# EAGLE design Wireless Temp Sensor (EAGLE 6.5.0)
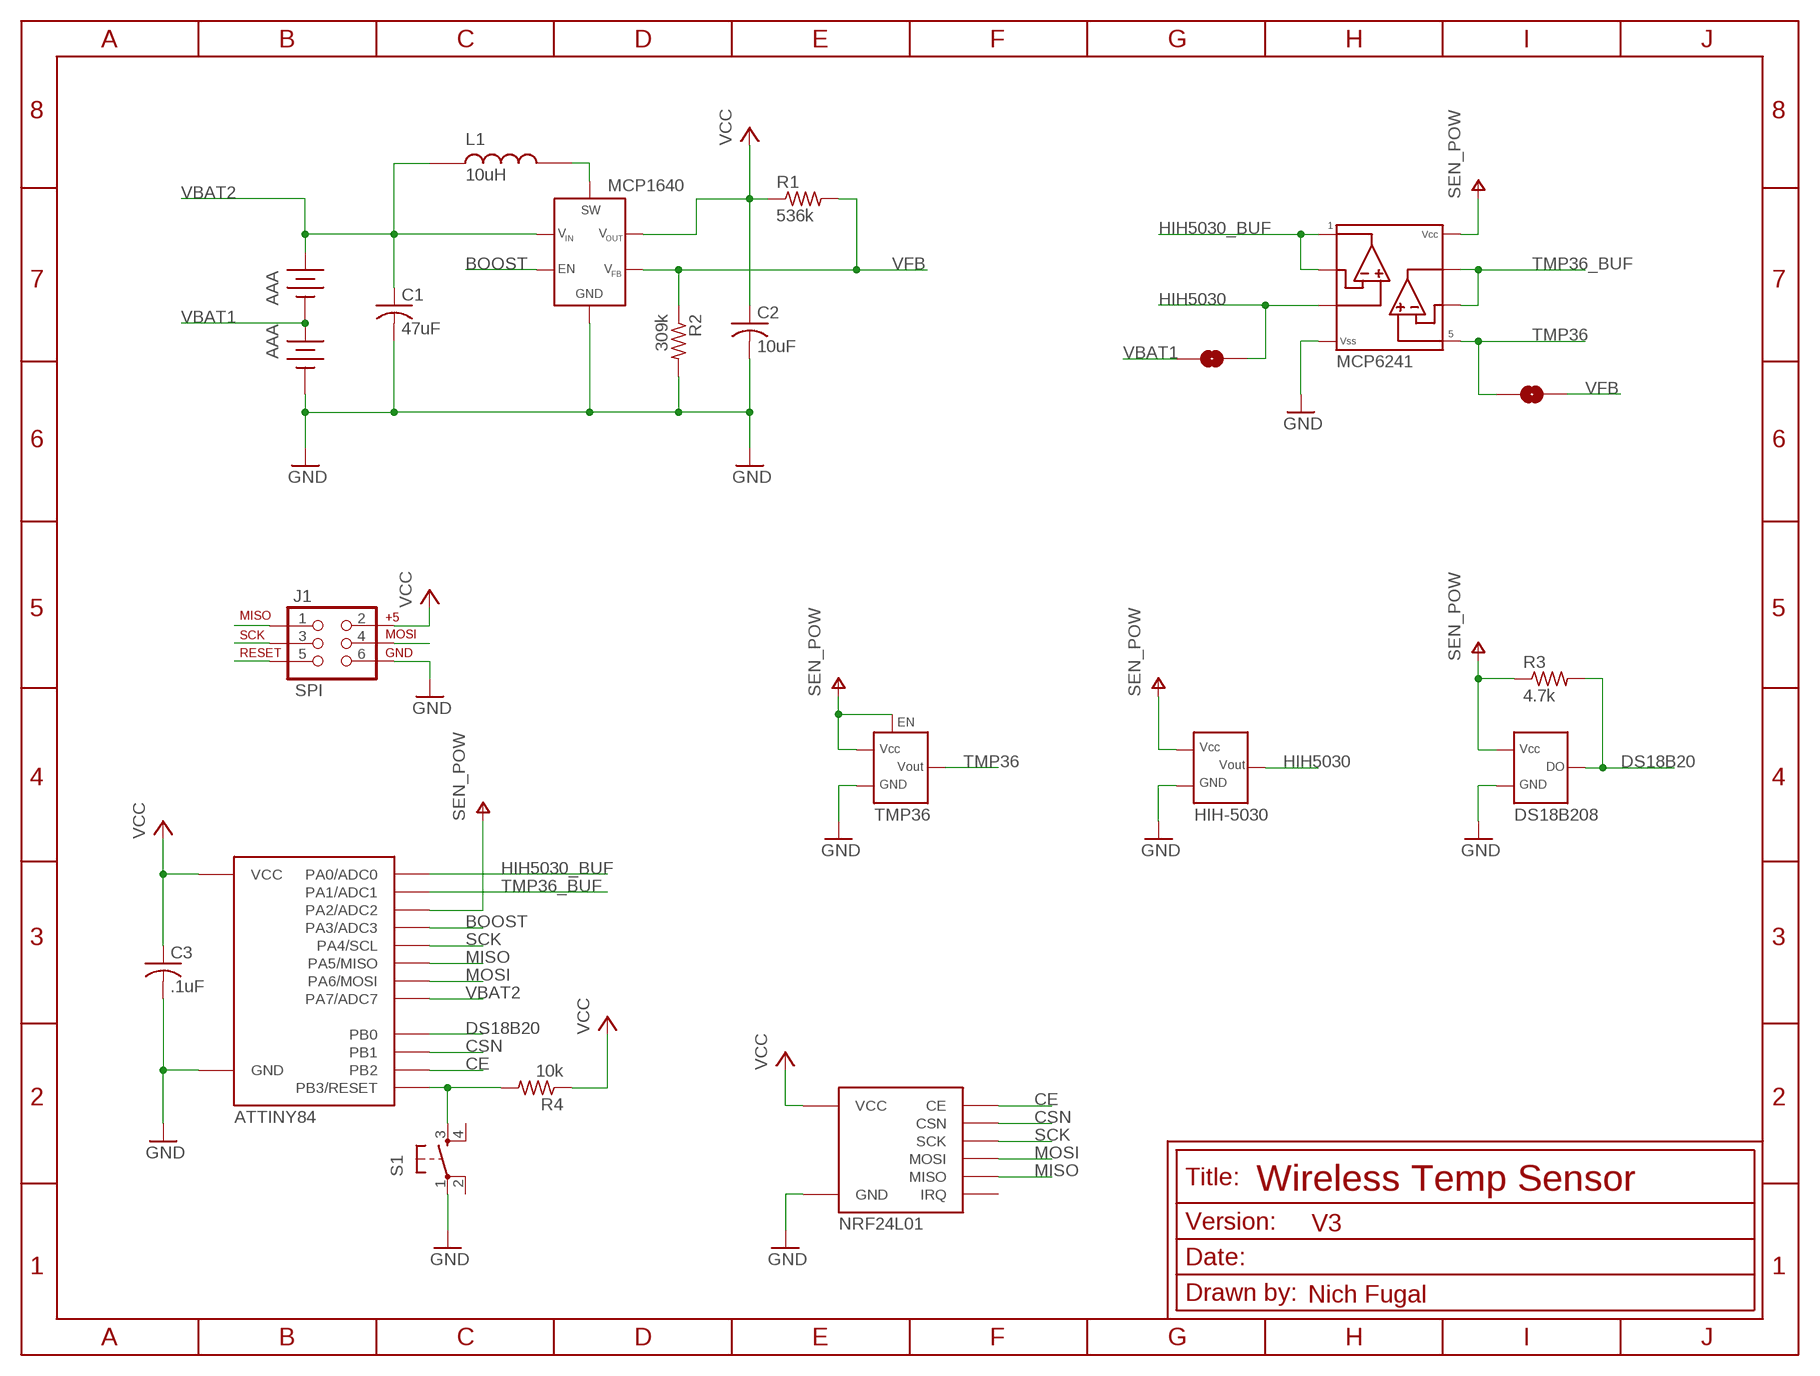
[diagram p0: schematic, sheet 1]

## Parts
C1  47uF  C-USC0805  [C0805]
C2  10uF  C-USC0805  [C0805]
C3  .1uF  C-USC0805  [C0805]
J1  SPI  AVR_SPI_PRG_6PTH  [2X3]
R1  536k  R-US_M0805  [M0805]
R2  309k  R-US_M0805  [M0805]
R3  4.7k  R-US_M0805  [M0805]
R4  10k  R-US_M0805  [M0805]
S1  TAC_SWITCHPTH  [TACTILE-PTH]
SJ1  SOLDERJUMPER-OLDNO  [SJ_2S-NO]
SJ2  SOLDERJUMPER-OLDNO  [SJ_2S-NO]
U1  TMP36  [SOT-23-5]
U$1  MCP1640  MCP1640SOT-23  [SOT-23]
U$2  10uH  INDUCTORSD3114  [SD3114]
U$3  AAA  [BK-82_MPD]
U$4  ATTINY84  ATTINY8414-DIP  [14-DIP]
U$5  NRF24L01  [NRF24L01]
U$6  DS18B208  DS18B208-MSOP  [8-MSOP]
U$7  HIH-5030  [HIH-5030]
U$8  AAA  [BK-82_MPD]
U$9  MCP6241  [8-SOIC]

## Nets
BOOST: U$1.3(EN) U$4.P$10(PA3/ADC3)
CE: U$4.P$5(PB2) U$5.P$3(CE)
CSN: U$4.P$3(PB1) U$5.P$4(CSN)
DS18B20: R3.2 U$4.P$2(PB0) U$6.P$1(DO)
GND: C1.2 C2.2 C3.2 J1.6 R2.2 S1.1 U1.5(GND) U$1.2(GND) U$4.P$14(GND) U$5.P$1(GND) U$6.P$4(GND) U$7.GND U$8.P$3(-) U$8.P$4(-) U$9.P$4
HIH5030: SJ1.1 U$7.OUT U$9.P$3
HIH5030_BUF: U$4.P$13(PA0/ADC0) U$9.P$1 U$9.P$2
MISO: J1.1 U$4.P$8(PA5/MISO) U$5.P$7(MISO)
MOSI: J1.4 U$4.P$7(PA6/MOSI) U$5.P$6(MOSI)
N$1: U$1.1(SW) U$2.P$2
RESET: J1.5 R4.2 S1.3 U$4.P$4(PB3/RESET)
SCK: J1.3 U$4.P$9(PA4/SCL) U$5.P$5(SCK)
SEN_POW: R3.1 U1.2(VCC) U1.4(EN) U$4.P$11(PA2/ADC2) U$6.P$8(VCC) U$7.VCC U$9.P$8
TMP36: SJ2.1 U1.1(VOUT) U$9.P$5
TMP36_BUF: U$4.P$12(PA1/ADC1) U$9.P$6 U$9.P$7
VBAT1: SJ1.2 U$3.P$3(-) U$3.P$4(-) U$8.P$1(+) U$8.P$2(+)
VBAT2: C1.1 U$1.6(VIN) U$2.P$1 U$3.P$1(+) U$3.P$2(+) U$4.P$6(PA7/ADC7)
VCC: C2.1 C3.1 J1.2 R1.1 R4.1 U$1.5(VOUT) U$4.P$1(VCC) U$5.P$2(VCC)
VFB: R1.2 R2.1 SJ2.2 U$1.4(VFB)
Unconnected: S1.2 S1.4 U$5.P$8(IRQ)

## Notes on the sheet
- L1
- 10uH
- AAA
- AAA
- V3
- Nich Fugal

## Library data of the parts
C1-C3 = rcl:C-US: CAPACITOR, American symbol
J1 = sparkfun:AVR_SPI_PRG_6: AVR ISP 6 Pin This is the reduced ISP connector for AVR programming. Common on Arduino. This footprint will take up less PCB space and can be used with a 10-pin to 6-pin adapter such as SKU: BOB-08508
R1-R4 = rcl:R-US_: RESISTOR, American symbol
S1 = sparkfun:TAC_SWITCH: Momentary Switch Button commonly used for reset or general input. Spark Fun Electronics SKU : COM-00097
SJ1 SJ2 = sparkfun:SOLDERJUMPER-OLD: Solder Jumper Standard SMD solder jumper. Used to automate production. Two varients : Normally Open and Normally Closed are the same, but have different paste layers. NC will have a large amount of paste and should jumper during reflow.
U1 = nich:TMP36
U$1 = nich:MCP1640: DC-DC Boost Converter
U$2 = nich:INDUCTOR
U$3 U$8 = nich:AAA
U$4 = nich:ATTINY84
U$5 = nich:NRF24L01
U$6 = nich:DS18B20
U$7 = nich:HIH-5030
U$9 = nich:MCP6241

## Board
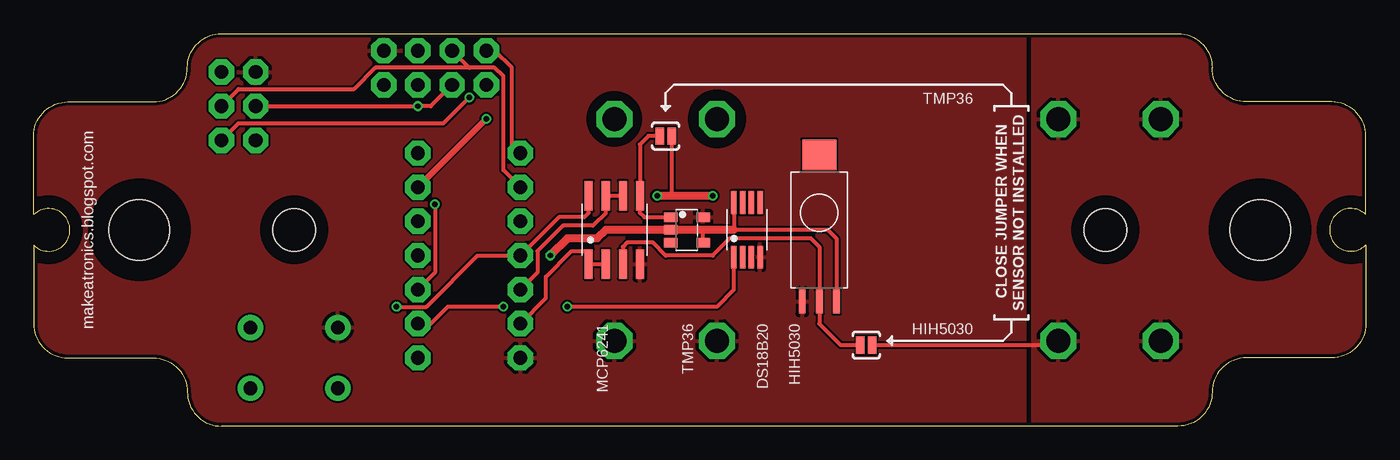
[diagram p1: board, top side]
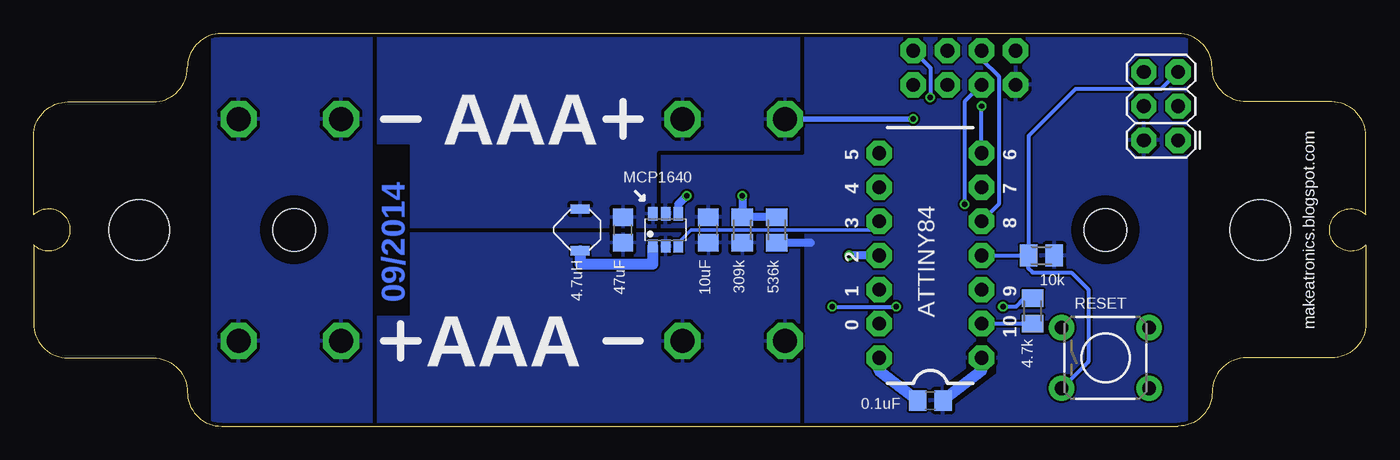
[diagram p2: board, bottom side, seen from below]

Size 99.06 x 29.21 mm. Coordinates in mm from the lower left corner, seen from the top.
Outline: 0,13.47 arc269 0,15.73 0,21.59 arc-90 2.54,24.13 8.89,24.13 arc90 11.43,26.67 arc-90 13.97,29.21 85.09,29.21 arc-90 87.63,26.67 arc90 90.17,24.13 96.52,24.13 arc-90 99.06,21.59 99.06,15.74 arc269 99.06,13.48 99.06,7.62 arc-90 96.52,5.08 90.17,5.08 arc90 87.63,2.54 arc-90 85.09,0 13.97,0 arc-90 11.43,2.54 arc90 8.89,5.08 2.54,5.08 arc-90 0,7.62 0,13.47
Copper layers (1*16): Top 0.035mm / dielectric 1.5mm / Bottom 0.035mm
Design rules "Fusion_eagle_rule_v1.1": minimum track width 6mil, minimum drill 12mil, track to track 6mil, track to pad 6mil, pad to pad 6mil, via to via 6mil, smd to smd 0mil, copper to edge 10mil, drill to drill 10mil, minimum pad ring 10mil, minimum via ring 6mil, stop-mask expansion 2mil, vias tented up to drill 100mil, thermal gap 10mil
Holes 3.17 mm at 19.37,14.61 79.69,14.61
Holes 4.5 mm at 7.86,14.61 91.2,14.61
tKeepout: area 17,5.1 to 21.7,24.1; area 77.3,5.1 to 82.1,24.1
bKeepout: area 4,10.8 to 11.7,18.4; area 87.4,10.8 to 95,18.4; 1 lines
tRestrict: area 48.8,20.9 to 52.8,24.9; area 41.3,21 to 45.1,24.8; area 4,10.8 to 11.7,18.4; area 87.4,10.8 to 95,18.4; area 77.2,12.1 to 82.2,17.1; area 16.8,12.1 to 21.9,17.1; area -1.4,12.1 to 3.7,17.1; area 95.4,12.1 to 100.5,17.1
bRestrict: area 27.6,1.4 to 31.3,6; area 71.1,8.3 to 73.7,21; area 16.8,12.1 to 21.9,17.1; area 77.2,12.1 to 82.2,17.1; 7 lines

### Footprints (pad centres in the part's own frame; a part is rotated, then mirrored left to right if it is on the bottom)
C0805 = smd 1.3 x 1.5: 1 -0.95,0; 2 0.95,0
2X3 = drill 1.016 pad 1.88 octagon: 1 0,0; 2 0,2.54; 3 2.54,0; 4 2.54,2.54; 5 5.08,0; 6 5.08,2.54
M0805 = smd 1.3 x 1.6: 1 -0.95,0; 2 0.95,0
TACTILE-PTH = drill 1.016 pad 1.88: 1 -3.251,2.261; 2 3.251,2.261; 3 -3.251,-2.261; 4 3.251,-2.261
SJ_2S-NO = smd 0.635 x 1.27: 1 -0.45,0; 2 0.45,0
SOT-23-5 = smd 0.7 x 1: 1 -0.95,-1.2; 2 0,-1.2; 3 0.95,-1.2; 4 0.95,1.2; 5 -0.95,1.2
SOT-23 = smd 0.7 x 1: 1 -0.95,-1.2; 2 0,-1.2; 3 0.95,-1.2; 4 0.95,1.2; 5 0,1.2; 6 -0.95,1.2
SD3114 = smd 0.7 x 1.4: P$1 -1.55,0; P$2 1.55,0
BK-82_MPD = drill 1.778 octagon: P$1 0.635,0; P$2 -6.985,0; P$3 -40.005,0; P$4 -32.385,0
14-DIP = drill 1.016 pad 1.88 octagon: P$1 0,0; P$2 2.54,0; P$3 5.08,0; P$4 7.62,0; P$5 10.16,0; P$6 12.7,0; P$7 15.24,0; P$8 15.24,7.62; P$9 12.7,7.62; P$10 10.16,7.62; P$11 7.62,7.62; P$12 5.08,7.62; P$13 2.54,7.62; P$14 0,7.62
NRF24L01 = drill 1.016 pad 1.88 octagon: P$1 0,0; P$2 -2.54,0; P$3 0,2.54; P$4 -2.54,2.54; P$5 0,5.08; P$6 -2.54,5.08; P$7 0,7.62; P$8 -2.54,7.62
8-MSOP = smd 1.702 x 0.406: P$1 -2.032,0; P$2 -2.032,-0.65; P$3 -2.032,-1.3; P$4 -2.032,-1.951; P$5 2.032,-1.951; P$6 2.032,-1.3; P$7 2.032,-0.65; P$8 2.032,0
HIH-5030 = smd 0.508 x 1.778: GND -1.27,-5.334; OUT 0,-5.334; VCC 1.27,-5.334 | smd 2.54 x 2.286: NC 0,5.588
8-SOIC = smd 0.6 x 2.2: P$1 -1.905,-2.54; P$2 -0.635,-2.54; P$3 0.635,-2.54; P$4 1.905,-2.54; P$5 1.905,2.54; P$6 0.635,2.54; P$7 -0.635,2.54; P$8 -1.905,2.54

### Placement (x,y rotation side)
C1  55.24,14.61 270 bottom
C2  48.9,14.61 270 bottom
C3  32.38,1.91 180 bottom
J1  13.97,21.27 90 bottom
R1  43.81,14.61 90 bottom
R2  46.35,14.61 270 bottom
R3  24.77,8.57 270 bottom
R4  24.13,12.7 180 bottom
S1  19.37,5.08 0 bottom
SJ1  61.91,6.03 0 top
SJ2  46.99,21.59 0 top
U1  48.58,14.61 270 top
U$1  52.07,14.61 0 bottom
U$2  58.42,14.61 270 bottom
U$3  43.81,22.86 0 bottom
U$4  28.57,5.08 90 bottom
U$5  26.04,27.94 90 bottom
U$6  52.07,14.61 90 top
U$7  58.42,14.61 0 top
U$8  83.19,6.35 180 bottom
U$9  43.18,14.61 0 top

### Tracks (layer width: path | path; a pad name or v marks a point on that pad's centre or on a via)
BOOST
  Bottom 0.254: U$1.3 51.12,13.65 50.16,14.61 36.83,14.61 U$4.P$10
CE
  Bottom 0.305: U$5.P$3 28.57,27.3 27.3,26.04 27.3,16.51 U$4.P$5
CSN  (via drill 0.41)
  Top 0.305: v29.84,16.51 29.84,11.43 U$4.P$3
  Bottom 0.305: U$5.P$4 29.84,24.13 v29.84,16.51
DS18B20  (via drill 0.41)
  Top 0.305: v39.69,8.89 50.8,8.89 52.07,10.16 U$6.P$1 | v34.92,8.89 30.8,8.89 29.53,7.62 U$4.P$2
  Bottom 0.305: v39.69,8.89 v34.92,8.89 | R3.2 U$4.P$2
GND
  Bottom 0.813: C3.2 36.2,4.13 U$4.P$14
  pour Bottom: 42.07,14.45 73.66,14.45 73.66,0 42.07,0
  pour Top: 73.66,0 0,0 0,29.21 73.66,29.21
HIH5030
  Top 0.305: U$9.P$3 43.81,13.34 44.13,13.65 46.04,13.65 46.99,12.7 50.48,12.7 51.75,13.97 57.78,13.97 58.42,13.34 U$7.OUT 58.42,7.62 60.01,6.03 SJ1.1
HIH5030_BUF
  Top 0.305: U$4.P$13 38.1,9.53 38.1,11.11 40.01,13.02 41.27,13.02 U$9.P$1 U$9.P$2
MISO  (via drill 0.41)
  Top 0.305: U$4.P$8 35.56,20.95 35.56,26.67 34.29,27.94 U$5.P$7 | J1.1 15.24,22.54 30.48,22.54 v32.38,24.45
  Bottom 0.305: U$5.P$7 32.38,26.67 v32.38,24.45
MOSI  (via drill 0.41)
  Top 0.305: J1.4 v28.57,23.81 29.53,23.81 U$5.P$6
  Bottom 0.305: U$4.P$7 v28.57,23.81
N$1
  Bottom 0.813: U$2.P$2 58.42,12.06 53.02,12.06 U$1.1
RESET
  Bottom 0.305: U$4.P$4 R4.2 | R4.2 25.08,11.74 24.77,11.43 21.91,11.43 20.64,10.16 20.64,4.8 S1.3 | J1.5 15.24,25.08 21.59,25.08 25.08,21.59 R4.2
SCK
  Top 0.305: U$4.P$9 34.92,19.05 34.92,26.04 34.29,26.67 32.38,26.67 | U$5.P$5 32.38,26.67 | 32.38,26.67 25.4,26.67 23.81,25.08 15.24,25.08 J1.3
SEN_POW  (via drill 0.41)
  Top 0.305: 49.78,14.61 50.16,14.61 | v26.99,8.89 29.21,8.89 33.02,12.7 U$4.P$11 39.05,15.56 40.96,15.56 41.27,15.88 U$9.P$8 | U$6.P$8 52.07,14.61 59.05,14.61 59.69,13.97 U$7.VCC | U1.4 49.78,14.36 49.53,14.61
  Top 0.61: 52.07,14.61 50.16,14.61 49.53,14.61 U1.2 42.55,14.61 41.91,13.97 39.69,13.97 v38.42,12.7
  Bottom 0.305: v26.99,8.89 26.04,8.89 25.4,9.53 R3.1
  Bottom 0.61: U$4.P$11 v38.42,12.7
TMP36
  Top 0.305: SJ2.1 45.72,21.59 45.09,20.95 U$9.P$5 45.09,15.88 45.41,15.55 U1.1
TMP36_BUF
  Top 0.305: U$4.P$12 37.47,11.43 37.47,13.02 39.37,14.92 41.59,14.92 42.55,15.88 U$9.P$7 U$9.P$6
VBAT1
  Top 0.305: SJ1.2 75.88,6.03 U$8.P$2
  pour Top: 74.3,29.21 74.3,0 99.06,0 99.06,29.21
  pour Bottom: 73.66,29.21 73.66,0 85.72,0 85.72,29.21
VBAT2  (via drill 0.41)
  Top 0.406: U$4.P$6 v33.66,22.86
  Bottom 0.406: v33.66,22.86 U$3.P$1
  pour Bottom: 76.83,14.76 76.83,29.21 41.91,29.21 41.91,20.32 52.55,20.32 52.55,17.3 52.7,16.19 52.7,14.76
VCC
  Bottom 0.61: R1.1 43.49,13.65 41.27,13.65
  Bottom 0.813: U$4.P$1 28.57,4.13 C3.1
  pour Bottom: 41.91,29.21 41.91,20.32 52.39,20.32 52.39,14.61 41.91,14.61 41.91,0 13.34,0 13.34,29.21
VFB  (via drill 0.41)
  Top 0.305: 48.9,17.14 47.44,17.33 SJ2.2
  Top 0.61: v46.35,17.14 48.9,17.14 v50.48,17.14
  Bottom 0.61: v46.35,17.14 R2.1 R1.2 | U$1.4 51.12,16.51 v50.48,17.14

### Text on the board
Bottom: 09/2014
tStop: V3.1
_tsilk: TMP36 | makeatronics.blogspot.com | CLOSE JUMPER WHEN | SENSOR NOT INSTALLED | MCP6241 | TMP36 | DS18B20 | HIH5030 | HIH5030
_bsilk: 6 | 5 | 7 | 4 | MCP1640 | 8 | 3 | makeatronics.blogspot.com | 2 | 536k | 309k | 10uF | 47uF | 4.7uH | 10k | RESET | 9 | 1 | 10 | ATTINY84 | 0 | 4.7k | 0.1uF